# EAGLE design Halcyon Audio Mixer (EAGLE 8.5.0)
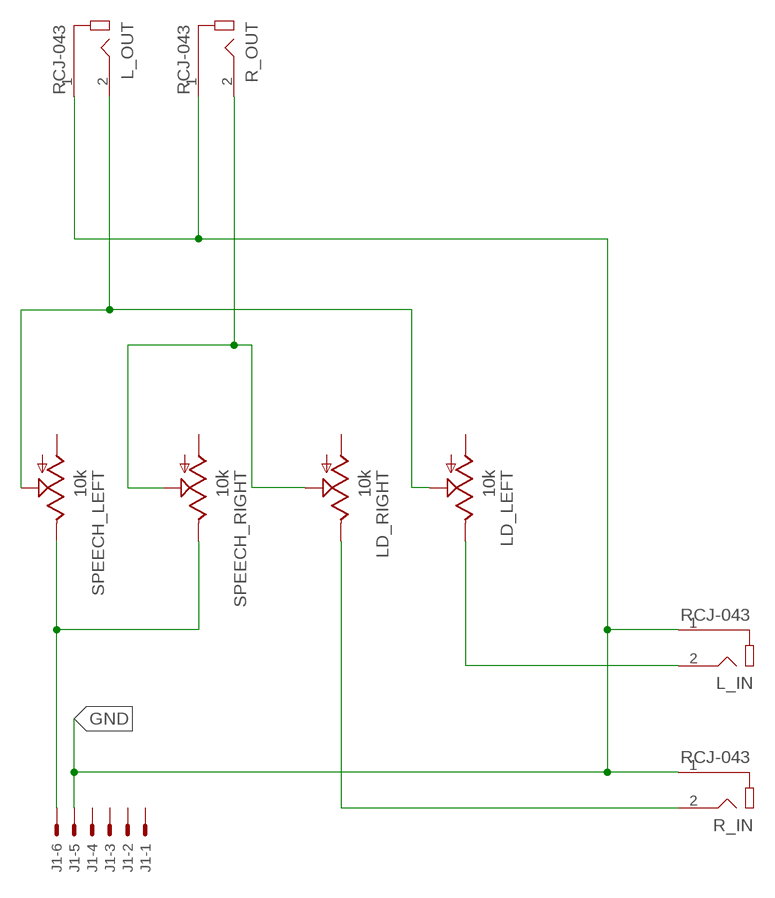
[diagram p0: schematic, sheet 1]

## Parts
J1  22-23-2061  [22-23-2061]
L_IN  RCJ-043  [CUI_RCJ-043]
L_OUT  RCJ-043  [CUI_RCJ-043]
LD_LEFT  10k  TRIM_US-B25P  [B25P]
LD_RIGHT  10k  TRIM_US-B25P  [B25P]
R_IN  RCJ-043  [CUI_RCJ-043]
R_OUT  RCJ-043  [CUI_RCJ-043]
SPEECH_LEFT  10k  TRIM_US-B25P  [B25P]
SPEECH_RIGHT  10k  TRIM_US-B25P  [B25P]

## Nets
GND: J1.5 L_IN.1 L_OUT.1 R_IN.1 R_OUT.1
N$1: L_IN.2 LD_LEFT.E
N$2: LD_RIGHT.E R_IN.2
N$3: L_OUT.2 LD_LEFT.S SPEECH_LEFT.S
N$6: J1.6 SPEECH_LEFT.E SPEECH_RIGHT.E
N$7: LD_RIGHT.S R_OUT.2 SPEECH_RIGHT.S
Unconnected: J1.1 J1.2 J1.3 J1.4 LD_LEFT.A LD_RIGHT.A SPEECH_LEFT.A SPEECH_RIGHT.A

## Library data of the parts
J1 = con-molex:22-23-2061: .100" (2.54mm) Center Header - 6 Pin; MF: MOLEX; MPN: 22-23-2061; OC_FARNELL: 1462922; OC_NEWARK: 27C1933
L_IN L_OUT R_IN R_OUT = RCJ-043:RCJ-043: Metal Right-Angle, RCA Jack, White Housing and Insulation Check prices <https://pricing.snapeda.com/parts/RCJ-043/CUI%20Devices/view-part?ref=eda>; AVAILABILITY: Good; CUI_PURCHASE_URL: https://www.cuidevices.com/product/interconnect/connectors/rca-connectors/rcj-04-series?utm_source=snapeda.com&utm_medium=referral&utm_campaign=snapedaBOM; DESCRIPTION: Metal Right-Angle, RCA Jack, White Housing and Insulation; MF: CUI Devices; MP: RCJ-043; PACKAGE: None; PRICE: None; PURCHASE-URL: https://pricing.snapeda.com/search/part/RCJ-043/?ref=eda
LD_LEFT LD_RIGHT SPEECH_LEFT SPEECH_RIGHT = pot:TRIM_US-: POTENTIOMETER

## Board
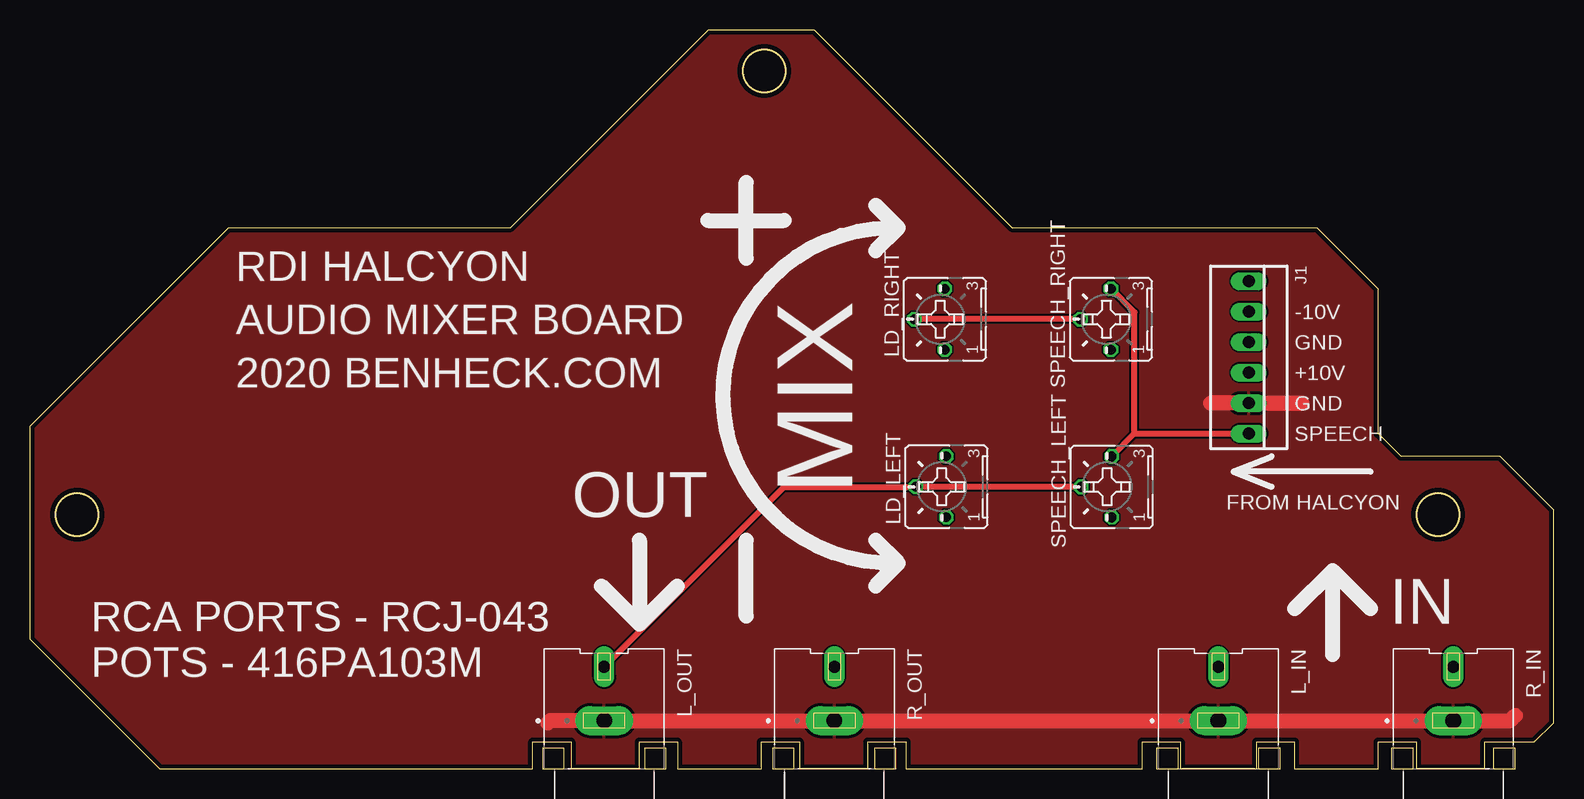
[diagram p1: board, top side]
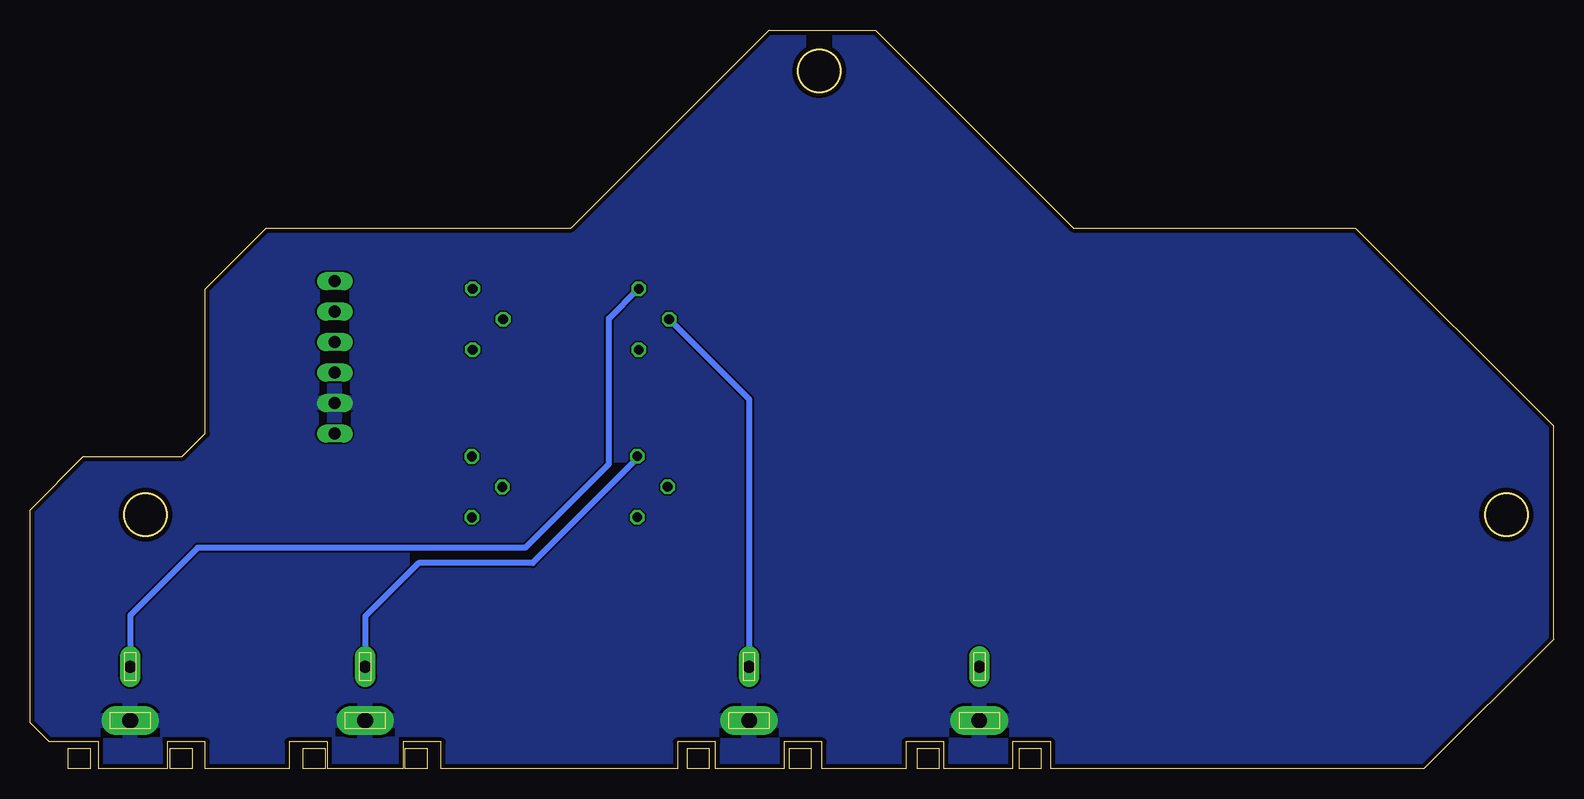
[diagram p2: board, bottom side, seen from below]

Size 127 x 61.59 mm. Coordinates in mm from the lower left corner, seen from the top.
Outline: 10.79,0 41.91,0 41.91,2.22 45.09,2.22 45.09,0 50.8,0 50.8,2.22 53.98,2.22 53.98,0 60.96,0 60.96,2.22 64.14,2.22 64.14,0 69.85,0 69.85,2.22 73.03,2.22 73.03,0 92.71,0 92.71,2.22 95.89,2.22 95.89,0 102.23,0 102.23,2.22 105.41,2.22 105.41,0 112.39,0 112.39,2.22 115.57,2.22 115.57,0 121.29,0 121.29,2.22 125.41,2.22 127,3.81 127,21.59 122.55,26.04 114.3,26.04 112.39,27.94 112.39,40.01 107.31,45.09 81.92,45.09 65.41,61.59 56.52,61.59 40.01,45.09 16.51,45.09 0,28.57 0,10.79 10.79,0
Outline: circle at 3.94,21.18 radius 1.78
Outline: circle at 61.21,58.17 radius 1.78
Outline: circle at 117.37,21.18 radius 1.78
Copper layers (1*16): Top 0.035559375mm / dielectric 1.6mm / Bottom 0.035559375mm
Design rules "oshpark-2layer": minimum track width 6mil, minimum drill 10mil, track to track 6mil, track to pad 6mil, pad to pad 6mil, via to via 6mil, smd to smd 6mil, copper to edge 15mil, drill to drill 6mil, minimum pad ring 5mil, minimum via ring 5mil, stop-mask expansion 2.5mil, vias tented up to drill 0mil, thermal gap 10mil

### Footprints (pad centres in the part's own frame; a part is rotated, then mirrored left to right if it is on the bottom)
22-23-2061 = drill 1 long: 1 -6.35,0; 2 -3.81,0; 3 -1.27,0; 4 1.27,0; 5 3.81,0; 6 6.35,0
CUI_RCJ-043 = drill 1.3 pad 2.4 long: 1 -4,0 | drill 1 pad 1.7 long: 2 -8.5,0
B25P = drill 0.813 octagon: A -2.54,0; E 2.54,0; S 0,2.54

### Placement (x,y rotation side)
J1  101.6,34.29 270 top
L_IN  99.06,0 270 top
L_OUT  47.87,0 270 top
LD_LEFT  76.39,23.5 90 top
LD_RIGHT  76.26,37.48 90 top
R_IN  118.64,0 270 top
R_OUT  67.06,0 270 top
SPEECH_LEFT  90.17,23.5 90 top
SPEECH_RIGHT  90.11,37.48 90 top

### Tracks (layer width: path | path; a pad name or v marks a point on that pad's centre or on a via)
GND
  Top 1.27: 106.05,30.48 J1.5 98.42,30.48 | 43.18,3.81 43.37,4 L_OUT.1 R_OUT.1 L_IN.1 R_IN.1 123.38,4 123.83,4.45
  pour Top: -8.89,-5.08 133.35,-5.08 133.35,40.64 105.41,68.58 3.81,68.58 -8.89,55.88
  pour Bottom: -11.43,-10.16 140.97,-10.16 140.97,71.12 -1.27,71.12 -6.35,66.04 -6.35,-5.08
N$1
  Bottom 0.508: LD_LEFT.E 76.39,25.85 85.09,17.14 94.61,17.14 99.06,12.7 L_IN.2
N$2
  Bottom 0.508: LD_RIGHT.E 78.74,37.53 78.74,25.4 85.72,18.41 113.03,18.41 118.64,12.8 R_IN.2
N$3
  Top 0.508: SPEECH_LEFT.S 73.86,23.5 | 73.86,23.5 LD_LEFT.S | L_OUT.2 62.86,23.5 73.86,23.5
N$6
  Top 0.508: 92.08,27.94 SPEECH_LEFT.E | 92.08,27.94 92.08,38.05 SPEECH_RIGHT.E | 92.08,27.94 J1.6
N$7
  Top 0.508: SPEECH_RIGHT.S LD_RIGHT.S
  Bottom 0.508: LD_RIGHT.S 67.06,30.81 R_OUT.2

### Text on the board
tPlace: RDI HALCYON | -10V | AUDIO MIXER BOARD | GND | 2020 BENHECK.COM | +10V | GND | SPEECH | OUT | MIX | FROM HALCYON | IN | RCA PORTS - RCJ-043 | POTS - 416PA103M